# EAGLE design LCDmain (EAGLE 7.4.0)
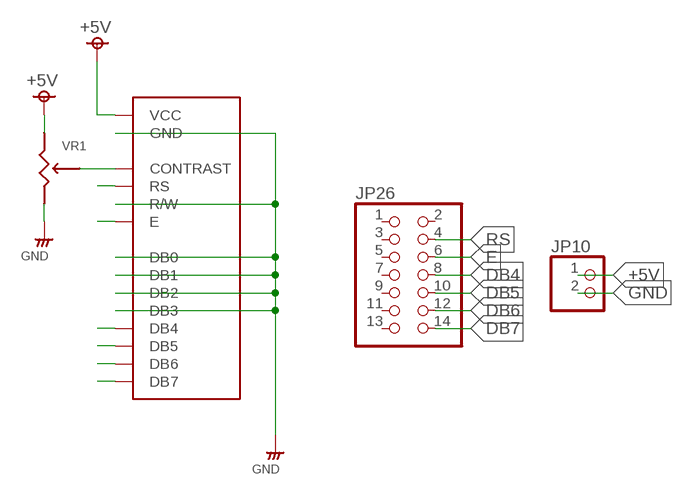
[diagram p0: schematic, sheet 1]

## Parts
JP10  PINHD-1X2"  [1*02]
JP26  PINHD-2X7  [2X07]
U$1  LCD_16X2  [LCD_16X2]
VR1  R-TRIM-3-L  [R_TRIM3]

## Nets
+5V: JP10.1 U$1.P$1(VCC) VR1.1
DB4: JP26.8 U$1.P$11(DB4)
DB5: JP26.10 U$1.P$12(DB5)
DB6: JP26.12 U$1.P$13(DB6)
DB7: JP26.14 U$1.P$14(DB7)
E: JP26.6 U$1.P$6(E)
GND: JP10.2 U$1.P$2(GND) U$1.P$5(R/W) U$1.P$7(DB0) U$1.P$8(DB1) U$1.P$9(DB2) U$1.P$10(DB3) VR1.3
N$2: U$1.P$3(CONTRAST) VR1.2
RS: JP26.4 U$1.P$4(RS)
Unconnected: JP26.1 JP26.2 JP26.3 JP26.5 JP26.7 JP26.9 JP26.11 JP26.13

## Library data of the parts
JP10 = pinhead_s:PINHD-1X2: PIN HEADER
JP26 = pinhead_s:PINHD-2X7: PIN HEADER
U$1 = LCD_s:LCD_16X2
VR1 = rcl__s:R-TRIM-3

## Board
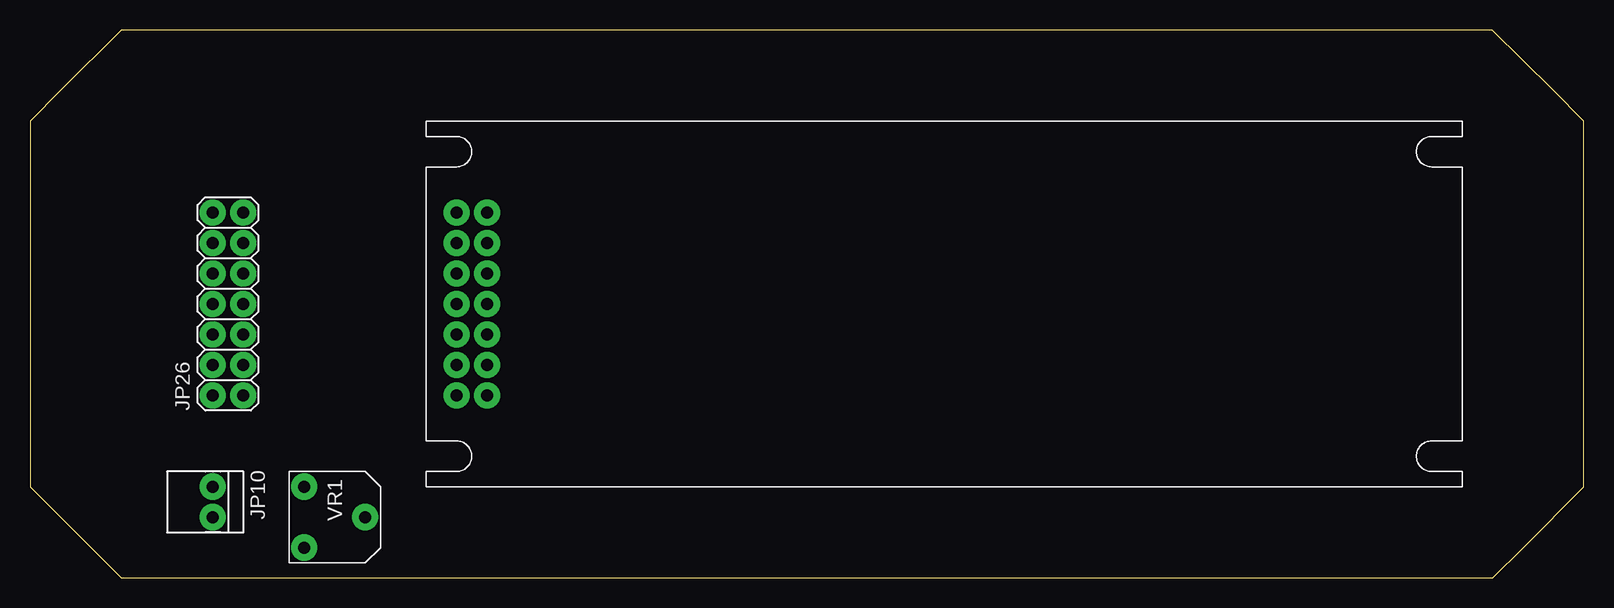
[diagram p1: board, top side]
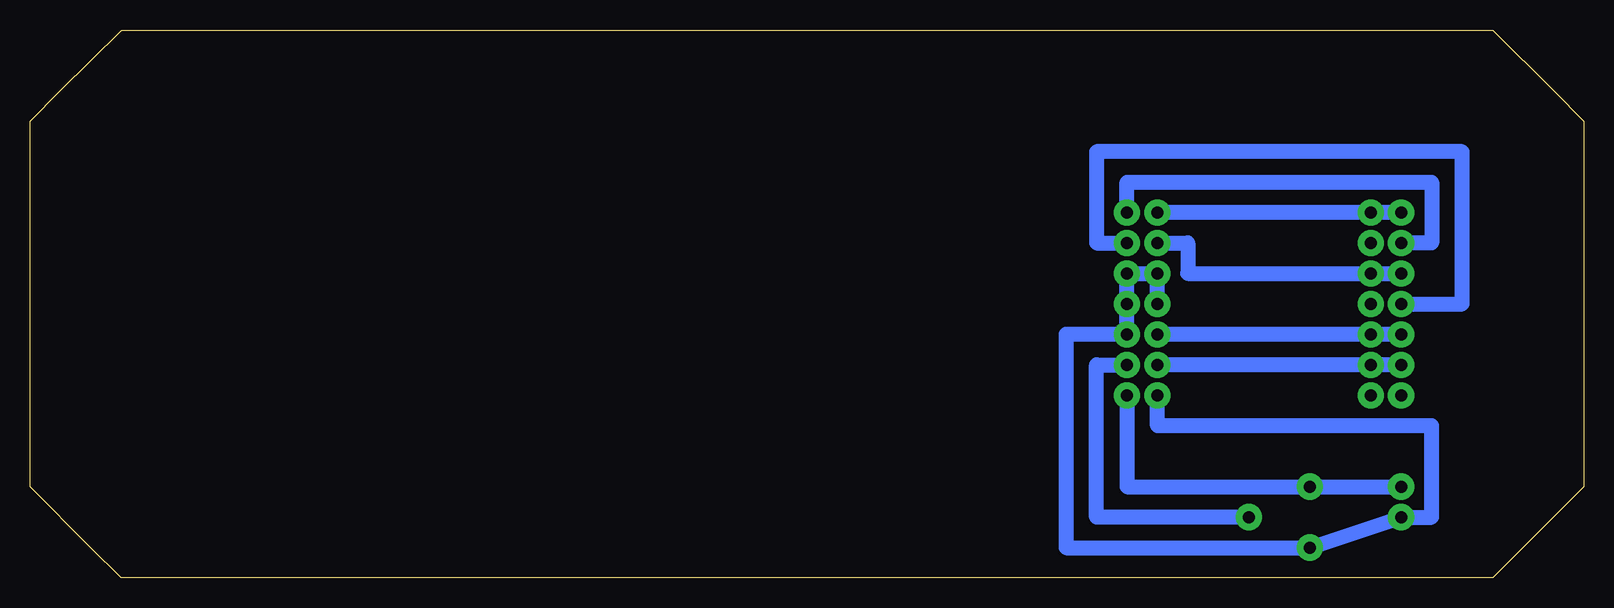
[diagram p2: board, bottom side, seen from below]

Size 129.54 x 45.71 mm. Coordinates in mm from the lower left corner, seen from the top.
Outline: 7.62,0 121.92,0 124.46,2.54 129.52,7.62 129.54,38.1 127,40.64 121.9,45.71 7.62,45.71 2.54,40.64 0,38.1 0,7.62 7.62,0
Copper layers (1*16): Top 0.035mm / dielectric 1.5mm / Bottom 0.035mm
Design rules "default": minimum track width 10mil, minimum drill 24mil, track to track 8mil, track to pad 8mil, pad to pad 8mil, via to via 8mil, smd to smd 8mil, copper to edge 40mil, drill to drill 8mil, minimum pad ring 10mil, minimum via ring 8mil, stop-mask expansion 4mil, vias tented up to drill 0mil, thermal gap 10mil

### Footprints (pad centres in the part's own frame; a part is rotated, then mirrored left to right if it is on the bottom)
1*02 = drill 1 pad 2.184: 1 -1.27,0; 2 1.27,0
2X07 = drill 1 pad 2.184: 1 -7.62,-1.27; 2 -7.62,1.27; 3 -5.08,-1.27; 4 -5.08,1.27; 5 -2.54,-1.27; 6 -2.54,1.27; 7 0,-1.27; 8 0,1.27; 9 2.54,-1.27; 10 2.54,1.27; 11 5.08,-1.27; 12 5.08,1.27; 13 7.62,-1.27; 14 7.62,1.27
LCD_16X2 = drill 1 pad 2.184: P$1 5.08,7.62; P$2 2.54,7.62; P$3 5.08,10.16; P$4 2.54,10.16; P$5 5.08,12.7; P$6 2.54,12.7; P$7 5.08,15.24; P$8 2.54,15.24; P$9 5.08,17.78; P$10 2.54,17.78; P$11 5.08,20.32; P$12 2.54,20.32; P$13 5.08,22.86; P$14 2.54,22.86
R_TRIM3 = drill 1 pad 2.184: 1 -2.54,-2.54; 2 0,2.54; 3 2.54,-2.54

### Placement (x,y rotation side)
JP10  15.24,6.35 270 top
JP26  16.51,22.86 90 top
U$1  33.02,7.62 0 top
VR1  25.4,5.08 270 top

### Tracks (layer width: path | path; a pad name or v marks a point on that pad's centre or on a via)
+5V
  Bottom 1.27: U$1.P$1 38.1,7.62 VR1.1 JP10.1
DB4
  Bottom 1.27: JP26.8 10.16,22.86 10.16,35.56 40.64,35.56 40.64,27.94 U$1.P$11
DB5
  Bottom 1.27: U$1.P$12 33.02,27.94 33.02,25.4 JP26.10
DB6
  Bottom 1.27: U$1.P$13 38.1,33.02 12.7,33.02 12.7,27.94 JP26.12
DB7
  Bottom 1.27: JP26.14 U$1.P$14
E
  Bottom 1.27: JP26.6 U$1.P$6
GND
  Bottom 1.27: U$1.P$2 35.56,12.7 12.7,12.7 12.7,5.08 JP10.2 VR1.3 43.18,2.54 43.18,20.32 U$1.P$5 U$1.P$7 U$1.P$9 U$1.P$10 U$1.P$8
N$2
  Bottom 1.27: VR1.2 40.64,5.08 40.64,17.78 U$1.P$3
RS
  Bottom 1.27: JP26.4 U$1.P$4